# Altium schematic sheet KHOI_HA_APP.SchDoc
size A; SheetNumber: 2; SheetTotal: 9
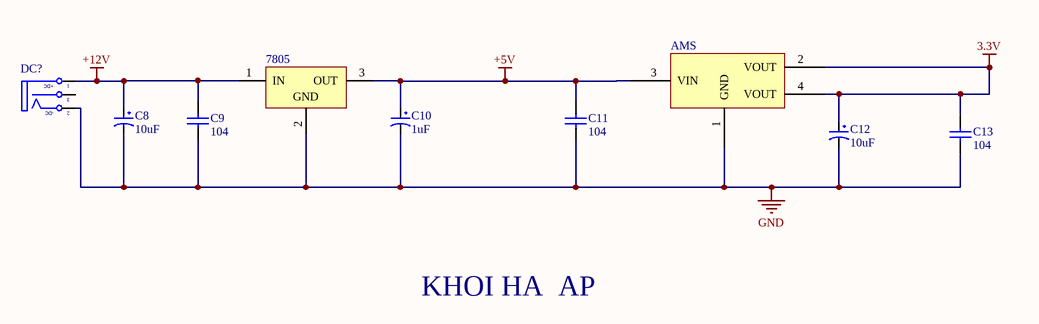
[diagram p0: KHOI_HA_APP.SchDoc]

## Parts
7805  78M05 SMD TO252  [TO252]  (value not drawn)
AMS  AMS1117-3.3V  [SOT223]  (value not drawn)
C8  10uF  [tu tantalum smd3216]
C9  104  [tu 0603]
C10  1uF  [tu tantalum smd3216]
C11  104  [tu 0603]
C12  10uF  [tu tantalum smd3216]
C13  104  [tu 0603]
DC?  JACK DC 5.5  [JACK DC 5.5]  (value not drawn)

## Nets
3.3V: AMS.2(VOUT) AMS.4(VOUT) C12.1 C13.1
+5V: 7805.3(OUT) AMS.3(VIN) C10.1 C11.1
+12V: 7805.1(IN) C8.1 C9.1 DC?.1(T)
GND: 7805.2(GND) AMS.1(GND) C8.2 C9.2 C10.2 C11.2 C12.2 C13.2 DC?.2(TN)

Not connected (* = marked no-connect by the designer): DC? 3(S)

## Notes on the sheet
- KHOI HA  AP
- (in symbol JACK DC 5.5) +DC; -DC

## Library data of the parts
7805 = 78M05 SMD TO252: Dán; Don_Vi: Con; Ten_Linh_Kien: 78M05 TO252; Ma_Hang: MH001917; Ghi_Chu: *; Kieu_Chan: *; Chung_Loai: Dán
AMS = AMS1117 SMD: Dán; Value: AMS1117-3.3V SOT223; Don_Vi: Con; Ma_Hang: MH000596; Ghi_Chu: *; Kieu_Chan: *; Chung_Loai: Dán
C8 C12 = Tu tantalum 10uF 16V SMD3216: Dán; Don_Vi: Con; So_Chan: 2; Ten_Linh_Kien: Tụ tantalum 106C-10uF 16V SMD3216; Ma_Hang: MH001954; Chung_Loai: Dán; Kieu_Chan: *
C9 C11 C13 = Tu 0603 104 50V 10%: Dán; Don_Vi: Con; So_Chan: 2; Ten_Linh_Kien: Tụ 0603 104-100nF 10% 50V; Ma_Hang: MH004568; Chung_Loai: Dán; Kieu_Chan: *
C10 = Tu tantalum 1uF 25V SMD3216: Dán; Don_Vi: Con; So_Chan: 2; Ten_Linh_Kien: Tụ tantalum 105E-1uF 25V SMD3216; Ma_Hang: MH007472; Chung_Loai: Dán; Kieu_Chan: *
DC? = JACK DC 5.5: Value: Jac DC